# EasyEDA Pro project v2_full_project.epro

# Schematic Schematic2_4
Board Name: 2_4_Minimised; Create Date: 2026-07-24; Page Name: P1; Project Name: Project_PetCollar; Schematic Name: Schematic2_4; Update Date: 2026-07-27; BladeWidth: 10; Company: 嘉立创EDA; Page Size: A4; RegionStart: 1; ShowBorder: 1; TitleBlock: 1; TitleBlockPosition: 3; Version: V1.0; XRegionCount: 6; YRegionCount: 4
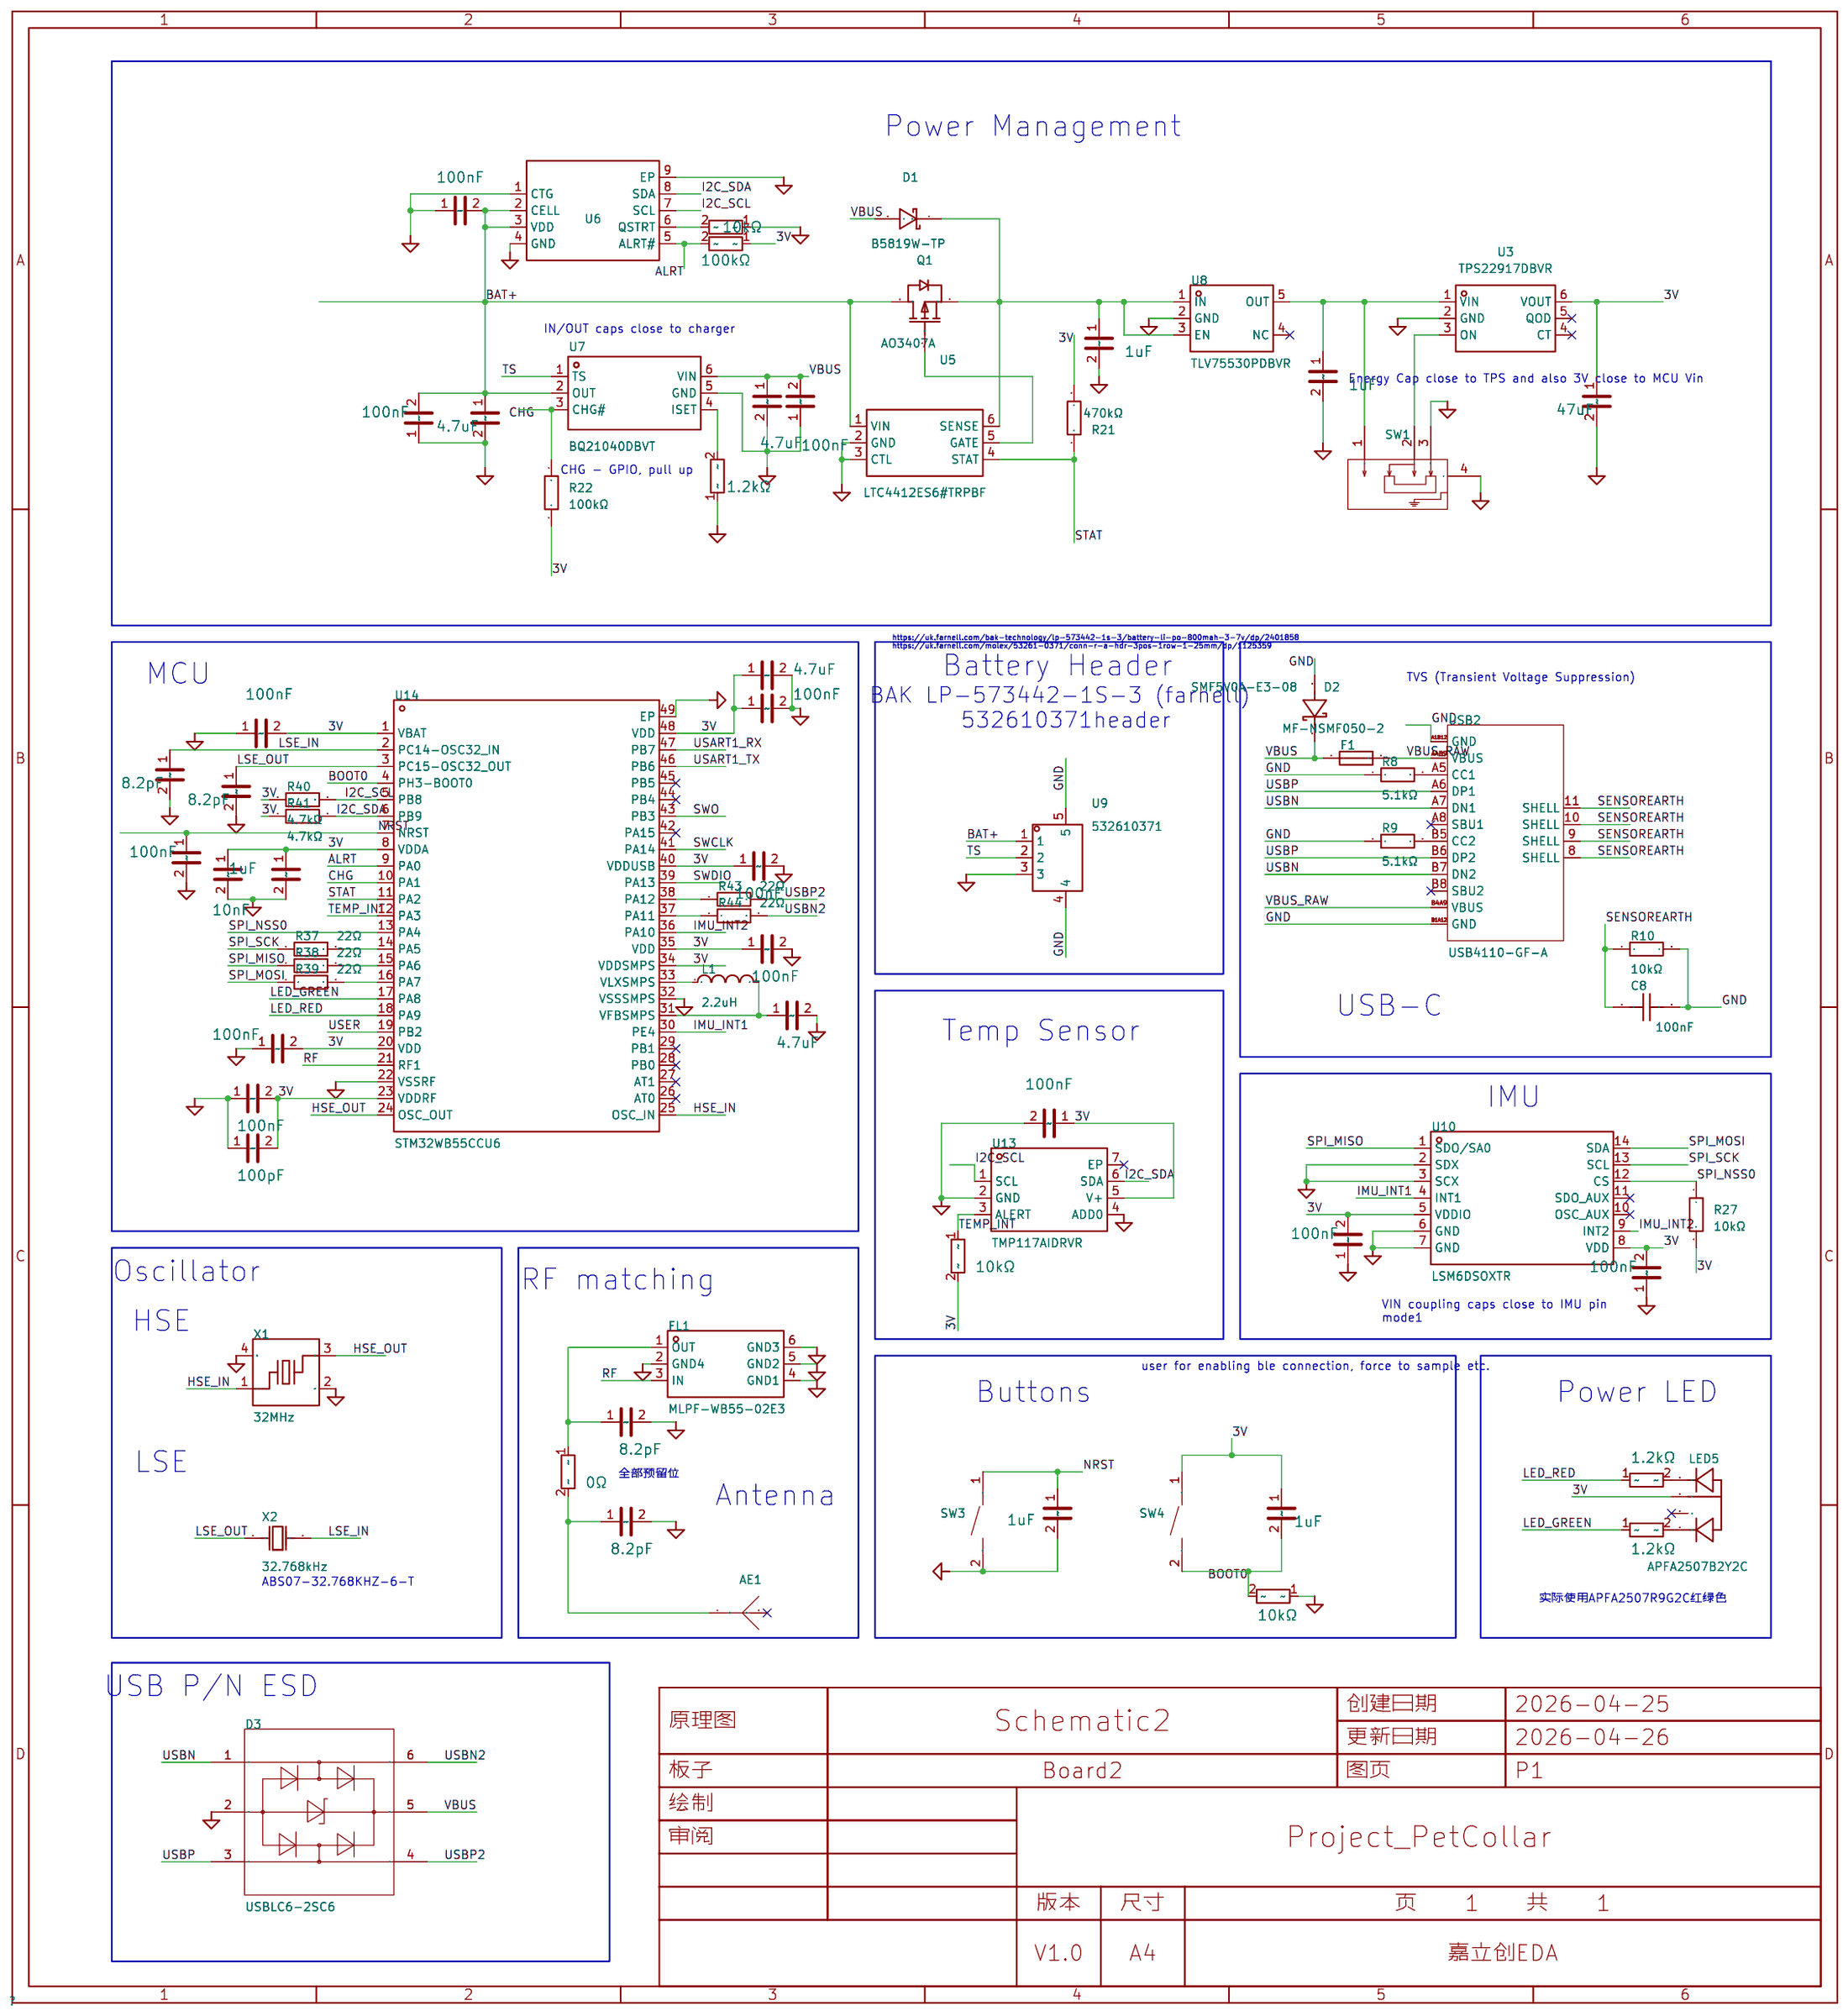
[diagram p0: schematic sheet]

## Parts
AE1  2450AT18A100E  [ANT-SMD_L3.2-W1.6]
C1  100nF  [C0603]
C2  1uF  [C0603]
C3  1uF  [C0603]
C5  47uF  [C0805]
C8  100nF  [C0603]
C19  1uF  [C0603]
C23  4.7uF  [C0603]
C24  4.7uF  [C0603]
C25  100nF  [C0603]
C26  100nF  [C0603]
C27  100nF  [C0603]
C28  100nF  [C0603]
C41  100nF  [C0603]
C42  8.2pF  [C0402]
C43  8.2pF  [C0402]
C46  4.7uF  [C0603]
C49  100nF  [C0603]
C50  100nF  [C0603]
C51  100nF  [C0603]
C52  4.7uF  [C0603]
C53  10nF  [C0603]
C54  1uF  [C0603]
C55  100nF  [C0603]
C56  100nF  [C0603]
C57  100pF  [C0603]
C58  100nF  [C0603]
C59  100nF  [C0603]
C60  1uF  [C0603]
C61  8.2pF  [C0402]
C62  8.2pF  [C0402]
D1  B5819W-TP  [SOD-123_L2.8-W1.8-LS3.7-RD]
D2  SMF5V0A-E3-08  [SMF_L2.8-W1.8-LS3.7-RD]
D3  USBLC6-2SC6  [SOT-23-6_L2.9-W1.6-P0.95-LS2.8-BL]
F1  MF-NSMF050-2  [F1206]
FL1  MLPF-WB55-02E3  [FILTER-SMD_6P-L1.6-W1.0-P0.50-BL]
L1  2.2uH  [L1008]
LED5  APFA2507B2Y2C  [LED-SMD_4P-L2.5-W1.0_APFA2507LQBDSEEZGKC]
Q1  AO3407A  [SOT-23-3_L2.9-W1.6-P1.90-LS2.8-BR]
R1  10kΩ  [R0603]
R2  100kΩ  [R0603]
R8  5.1kΩ  [R0603]
R9  5.1kΩ  [R0603]
R10  10kΩ  [R0603]
R20  1.2kΩ  [R0603]
R21  470kΩ  [R0603]
R22  100kΩ  [R0603]
R27  10kΩ  [R0603]
R35  10kΩ  [R0603]
R36  0Ω  [R0402]
R37  22Ω  [R0603]
R38  22Ω  [R0603]
R39  22Ω  [R0603]
R40  4.7kΩ  [R0603]
R41  4.7kΩ  [R0603]
R42  10kΩ  [R0603]
R43  22Ω  [R0603]
R44  22Ω  [R0603]
R45  1.2kΩ  [R0603]
R46  1.2kΩ  [R0603]
SW1  MSK12C02  [SW-TH_MSK12C02]
SW3  TS-1088-AR02016  [SW-SMD_L3.9-W3.0-P4.45]
SW4  TS-1088-AR02016  [SW-SMD_L3.9-W3.0-P4.45]
U3  TPS22917DBVR  [SOT-23-6_L2.9-W1.6-P0.95-LS2.8-BR]
U5  LTC4412ES6#TRPBF  [TSOT-23-6_L2.9-W1.6-P0.95-LS2.8-BR]
U6  MAX17048G+T10  [TDFN-8_L2.0-W2.0-P0.50-BL-EP1.2]
U7  BQ21040DBVT  [SOT-23-6_L2.9-W1.6-P0.95-LS2.8-BR]
U8  TLV75530PDBVR  [SOT-23-5_L3.0-W1.7-P0.95-LS2.8-BR]
U9  532610371  [CONN-TH_532610371]
U10  LSM6DSOXTR  [LGA-14L_L3.0-W2.5-P0.50-TL]
U13  TMP117AIDRVR  [WSON-6_L2.0-W2.0-P0.65-TL-EP]
U14  STM32WB55CCU6  [VQFN-48_L7.0-W7.0-P0.50-BL-EP5.5]
USB2  USB4110-GF-A  [USB-C-SMD_TYPE-C-16P-USB4110-GF-A]
X1  32MHz  [CRYSTAL-SMD_4P-L2.0-W1.6-BL]
X2  32.768kHz  [CRYSTAL-SMD_L3.2-W1.5-2]

## Library data of the parts
AE1 = 2450AT18A100E: 天线类型:2.4G天线;中心频点:2.4GHz;带宽:-;峰值增益:0.5dBi;极化方式:-;功率容量:2W;驻波比:-;; LCSC Part Name: 2.4G天线; Supplier Part: C89334; Manufacturer: JOHANSON(约翰逊); Supplier Footprint: 1206; JLCPCB Part Class: Extended Part; Datasheet: https://atta.szlcsc.com/upload/public/pdf/source/20180301/C89334_15198946260391384223.pdf; Supplier: LCSC; Antenna Type: 2.4G天线; Central Frequency: 2.4GHz; Peak Gain: 0.5dBi; Impedance: 50Ω; Power capacity: 2W; Operating Temperature: -40℃~+125℃
C1 C25-C28 C41 C49-C51 C55 C56 C58 C59 = CL10B104KB8NNNC: 容值:100nF;精度:±10%;额定电压:50V;温度系数:X7R;; LCSC Part Name: 100nF ±10% 50V; Supplier Part: C1591; Manufacturer: SAMSUNG(三星); Supplier Footprint: 0603; JLCPCB Part Class: Extended Part; Datasheet: https://item.szlcsc.com/datasheet/CL10B104KB8NNNC/1943.html; Supplier: LCSC; Tolerance: ±10%; Voltage Rating: 50V; Temperature Coefficient: X7R
C2 C3 C19 C54 C60 = CL10B105KA8NNNC: 容值:1uF;精度:±10%;额定电压:25V;温度系数:X7R;; LCSC Part Name: 1uF ±10% 25V; Supplier Part: C29936; Manufacturer: SAMSUNG(三星); Supplier Footprint: 0603; JLCPCB Part Class: Extended Part; Datasheet: https://item.szlcsc.com/datasheet/CL10B105KA8NNNC/30690.html; Supplier: LCSC; Tolerance: ±10%; Voltage Rating: 25V; Temperature Coefficient: X7R
C5 = CL21A476MQYNNNE: 容值:47uF;精度:±20%;额定电压:6.3V;温度系数:X5R;; LCSC Part Name: 47uF ±20% 6.3V; Supplier Part: C16780; Manufacturer: SAMSUNG(三星); Supplier Footprint: 0805; JLCPCB Part Class: Basic Part; Datasheet: https://item.szlcsc.com/datasheet/CL21A476MQYNNNE/17464.html; Supplier: LCSC; Tolerance: ±20%; Voltage Rating: 6.3V; Temperature Coefficient: X5R
C8 = CL10B104KB8NNNC: LCSC Part Name: 100nF ±10% 50V; Supplier Part: C1591; Manufacturer: SAMSUNG(三星); Supplier Footprint: 0603; JLCPCB Part Class: Extended Part; Datasheet: https://item.szlcsc.com/datasheet/CL10B104KB8NNNC/1943.html; Supplier: LCSC; Tolerance: ±10%; Voltage Rating: 50V; Temperature Coefficient: X7R
C23 C24 C46 C52 = CL10A475KO8NNNC: 容值:4.7uF;精度:±10%;额定电压:16V;温度系数:X5R;; LCSC Part Name: 4.7uF ±10% 16V; Supplier Part: C19666; Manufacturer: SAMSUNG(三星); Supplier Footprint: 0603; JLCPCB Part Class: Basic Part; Datasheet: https://item.szlcsc.com/datasheet/CL10A475KO8NNNC/20375.html; Supplier: LCSC; Tolerance: ±10%; Voltage Rating: 16V; Temperature Coefficient: X5R
C42 C43 C61 C62 = GJM1555C1H8R2BB01D: 容值:8.2pF;额定电压:50V;材质(温度系数):C0G;; LCSC Part Name: 8.2pF 50V; Supplier Part: C161336; Manufacturer: muRata(村田); Supplier Footprint: 0402; JLCPCB Part Class: Extended Part; Datasheet: https://atta.szlcsc.com/upload/public/pdf/source/20180122/C161336_15166126268751291267.pdf; Supplier: LCSC; Voltage Rated: 50V; Temperature Coefficient: C0G
C53 = GRM1885C1H103JA01D: 容值:10nF;精度:±5%;额定电压:50V;材质(温度系数):C0G;; LCSC Part Name: 10nF ±5% 50V; Supplier Part: C85973; Manufacturer: muRata(村田); Supplier Footprint: 0603; JLCPCB Part Class: Extended Part; Datasheet: https://atta.szlcsc.com/upload/public/pdf/source/20200305/C490387_23319AE8C154DEB24C505E6C82A8106A.pdf; Supplier: LCSC; Tolerance: ±5%; Voltage Rated: 50V; Temperature Coefficient: C0G
C57 = CL10C101JB8NNNC: 容值:100pF;精度:±5%;额定电压:50V;温度系数:C0G;; LCSC Part Name: 100pF ±5% 50V; Supplier Part: C14858; Manufacturer: SAMSUNG(三星); Supplier Footprint: 0603; JLCPCB Part Class: Basic Part; Datasheet: https://item.szlcsc.com/datasheet/CL10C101JB8NNNC/15530.html; Supplier: LCSC; Tolerance: ±5%; Voltage Rating: 50V; Temperature Coefficient: C0G
D1 = B5819W-TP: 二极管配置:-;正向压降(Vf):600mV@1A;直流反向耐压(Vr):40V;整流电流:1A;; LCSC Part Name: 电压:40V 电流:1A; Supplier Part: C84354; Manufacturer: MCC(美微科); Supplier Footprint: SOD-123; JLCPCB Part Class: Extended Part; Datasheet: https://item.szlcsc.com/datasheet/B5819W-TP/85524.html; Supplier: LCSC; Voltage - Forward(Vf@If): 600mV@1A; Voltage - DC Reverse(Vr): 40V; Current - Rectified: 1A; Reverse Leakage Current (Ir): 1mA@40V; Operating Junction Temperature Range: -65℃~+125℃; Non-Repetitive Peak Forward Surge Current: 10A
D2 = SMF5V0A-E3-08: Supplier Part: C1972946; Manufacturer: VISHAY(威世); Supplier Footprint: SMF(DO-219AB); JLCPCB Part Class: 扩展库; Datasheet: https://item.szlcsc.com/datasheet/SMF5V0A-E3-08/2064484.html; Supplier: LCSC; Polarity: 单向; Reverse Stand-Off Voltage (Vrwm): 5V; Clamping Voltage: 9.2V; Peak Pulse Current (Ipp): 21.7A@10/1000us; Peak Pulse Power Dissipation (Ppp): 1kW@8/20us; Voltage - Breakdown: 7.1V; Reverse Leakage Current (Ir): 5uA; Number of Channels: 单路; level of protection: IEC 61000-4-2; Type: ESD; Junction Capacitance: 1120pF
D3 = USBLC6-2SC6_C7519: 极性:单向;反向截止电压(Vrwm):5.25V;钳位电压:17V;峰值脉冲电流(Ipp):5A;击穿电压:6V;; LCSC Part Name: 单向ESD; Supplier Part: C7519; Manufacturer: ST(意法半导体); Supplier Footprint: SOT-23-6L; JLCPCB Part Class: 扩展库; Datasheet: https://item.szlcsc.com/datasheet/USBLC6-2SC6/7996.html; Supplier: LCSC; Polarity: 单向; Reverse Stand-Off Voltage (Vrwm): 5.25V; Clamping Voltage: 17V; Peak Pulse Current (Ipp): 5A; Voltage - Breakdown: 6V; Reverse Leakage Current (Ir): 150nA; Number of Channels: 双路; Operating Temperature: -40℃~+125℃; level of protection: IEC 61000-4-2; Type: ESD; Junction Capacitance: 3.5pF
F1 = MF-NSMF050-2: LCSC Part Name: 0.5A 13.2V 自恢复保险丝; Supplier Part: C75464; Manufacturer: BOURNS; Supplier Footprint: 1206; JLCPCB Part Class: 扩展库; Datasheet: https://item.szlcsc.com/datasheet/MF-NSMF050-2/76588.html; Supplier: LCSC; Resistance - Initial (Ri) (Min): 150mΩ; Resistance - Post Trip (R1) (Max): 700mΩ; Operating Temperature: -40℃~+85℃
FL1 = MLPF-WB55-02E3: LCSC Part Name: 2.45GHz 中心 低通; Supplier Part: C1855732; Manufacturer: ST(意法半导体); Supplier Footprint: SMD-6P,1.6x1mm; JLCPCB Part Class: 扩展库; Datasheet: https://item.szlcsc.com/datasheet/MLPF-WB55-02E3/1946545.html; Supplier: LCSC; Filter Type: 低通; Absolute Bandwidth: 2.4GHz~2.5GHz; Attenuation: 45dB；53dB；44dB；56dB; Impedance: 50Ω; Insertion Loss: 1.2dB; Operating Temperature: -40℃~+105℃
L1 = 1239AS-H-2R2M=P2: LCSC Part Name: 2.2uH ±20% 2.2A; Supplier Part: C237285; Manufacturer: muRata(村田); Supplier Footprint: 1008; JLCPCB Part Class: Extended Part; Datasheet: https://item.szlcsc.com/datasheet/1239AS-H-2R2M%253DP2/236729.html; Supplier: LCSC; Tolerance: ±20%; Current Rating: 2A; Current - Saturation(Isat): 2.2A; DC Resistance(DCR): 108mΩ
LED5 = APFA2507B2Y2C: Supplier Part: C5588645; Manufacturer: Kingbright; Supplier Footprint: SMD-4P,2.5x1.1mm; JLCPCB Part Class: 扩展库; Datasheet: https://atta.szlcsc.com/upload/public/pdf/source/20240415/D4824275CE3160FAD1C5EE74365E5F09.pdf; Supplier: LCSC; Emitted Color: 黄色,蓝色; Forward Voltage (VF): 2V；3.3V; Forward Current: 20mA; Dominant Wavelength: 590nm；465nm; Peak Wavelength: 590nm；460nm; Diode Configuration: 共阳极; Lens Color: 无色透明透镜; Luminous Intensity: 52.5mcd；105mcd; Viewing Angle: 130°
Q1 = AO3407A_C15155: 数量:1个P沟道;漏源电压(Vdss):30V;连续漏极电流(Id):4.3A;导通电阻(RDS(on)):48mΩ@10V;耗散功率(Pd):-;阈值电压(Vgs(th)):2.5V@250uA;; LCSC Part Name: 1个P沟道 耐压:30V 电流:4.3A; Supplier Part: C15155; Manufacturer: AOS; Supplier Footprint: SOT-23; JLCPCB Part Class: Extended Part; Datasheet: https://item.szlcsc.com/datasheet/AO3407A/15829.html; Supplier: LCSC; Number: 1个P沟道; Drain to Source Voltage: 30V; Current - Continuous Drain(Id): 4.3A; RDS(on): 48mΩ@10V; Gate Threshold Voltage (Vgs(th)): 2.5V@250uA; Gate Charge(Qg): 16nC@10V; Input Capacitance(Ciss): 830pF; Reverse Transfer Capacitance (Crss@Vds): 92pF@15V
R1 R35 R42 = RC0603FR-0710KL: 电阻类型:厚膜电阻;阻值:10kΩ;精度:±1%;功率:100mW;最大工作电压:75V;温度系数:±100ppm/℃;; LCSC Part Name: 厚膜电阻 10kΩ ±1% 100mW; Supplier Part: C98220; Manufacturer: YAGEO(国巨); Supplier Footprint: 0603; JLCPCB Part Class: Extended Part; Datasheet: https://atta.szlcsc.com/upload/public/pdf/source/20180927/C295883_E8D83085EA81BD7DE0B2B681138C15EE.pdf; Supplier: LCSC; Type: 厚膜电阻; Tolerance: ±1%; Power(Watts): 100mW; Overload Voltage (Max): 75V; Temperature Coefficient: ±100ppm/℃; Operating Temperature Range: -55℃~+155℃
R2 = RC0603FR-07100KL: 电阻类型:厚膜电阻;阻值:100kΩ;精度:±1%;功率:100mW;最大工作电压:75V;温度系数:±100ppm/℃;; LCSC Part Name: 厚膜电阻 100kΩ ±1% 100mW; Supplier Part: C14675; Manufacturer: YAGEO(国巨); Supplier Footprint: 0603; JLCPCB Part Class: Extended Part; Datasheet: https://atta.szlcsc.com/upload/public/pdf/source/20140324/1457707028752.pdf; Supplier: LCSC; Type: 厚膜电阻; Tolerance: ±1%; Power(Watts): 100mW; Overload Voltage (Max): 75V; Temperature Coefficient: ±100ppm/℃; Operating Temperature Range: -55℃~+155℃
R8 R9 = FRC0603F5102TS: LCSC Part Name: 51kΩ ±1% 100mW 厚膜电阻; Supplier Part: C2907049; Manufacturer: FOJAN(富捷); Supplier Footprint: 0603; JLCPCB Part Class: Extended Part; Supplier: LCSC; Type: 厚膜电阻; Tolerance: ±1%; Power(Watts): 100mW; Voltage-Supply(Max): 75V; Temperature Coefficient: ±100ppm/℃; Operating Temperature: -55℃~+155℃
R10 R27 = RC0603FR-0710KL: LCSC Part Name: 厚膜电阻 10kΩ ±1% 100mW; Supplier Part: C98220; Manufacturer: YAGEO(国巨); Supplier Footprint: 0603; JLCPCB Part Class: Extended Part; Datasheet: https://atta.szlcsc.com/upload/public/pdf/source/20180927/C295883_E8D83085EA81BD7DE0B2B681138C15EE.pdf; Supplier: LCSC; Type: 厚膜电阻; Tolerance: ±1%; Power(Watts): 100mW; Overload Voltage (Max): 75V; Temperature Coefficient: ±100ppm/℃; Operating Temperature Range: -55℃~+155℃
R20 R45 R46 = RC0603FR-071K2L: 电阻类型:厚膜电阻;阻值:1.2kΩ;精度:±1%;功率:100mW;工作电压:75V;温度系数:±100ppm/℃;; LCSC Part Name: 厚膜电阻 1.2kΩ ±1% 100mW; Supplier Part: C114605; Manufacturer: YAGEO(国巨); Supplier Footprint: 0603; JLCPCB Part Class: Extended Part; Datasheet: https://item.szlcsc.com/datasheet/RC0603FR-071K2L/115849.html; Supplier: LCSC; Type: 厚膜电阻; Tolerance: ±1%; Power(Watts): 100mW; Voltage-Supply(Max): 75V; Temperature Coefficient: ±100ppm/℃; Operating Temperature: -55℃~+155℃
R21 = FRC0603F4703TS: LCSC Part Name: 470kΩ ±1% 100mW 厚膜电阻; Supplier Part: C2907040; Manufacturer: FOJAN(富捷); Supplier Footprint: 0603; JLCPCB Part Class: Extended Part; Supplier: LCSC; Type: 厚膜电阻; Tolerance: ±1%; Power(Watts): 100mW; Voltage-Supply(Max): 75V; Temperature Coefficient: ±100ppm/℃; Operating Temperature: -55℃~+155℃
R22 = RC0603FR-07100KL: LCSC Part Name: 厚膜电阻 100kΩ ±1% 100mW; Supplier Part: C14675; Manufacturer: YAGEO(国巨); Supplier Footprint: 0603; JLCPCB Part Class: Extended Part; Datasheet: https://atta.szlcsc.com/upload/public/pdf/source/20140324/1457707028752.pdf; Supplier: LCSC; Type: 厚膜电阻; Tolerance: ±1%; Power(Watts): 100mW; Overload Voltage (Max): 75V; Temperature Coefficient: ±100ppm/℃; Operating Temperature Range: -55℃~+155℃
R36 = RC0402FR-070RL: 电阻类型:厚膜电阻;阻值:0Ω;精度:±1%;功率:62.5mW;工作电压:50V;温度系数:-;; LCSC Part Name: 厚膜电阻 0Ω ±1% 62.5mW; Supplier Part: C106231; Manufacturer: YAGEO(国巨); Supplier Footprint: 0402; JLCPCB Part Class: Extended Part; Datasheet: https://item.szlcsc.com/datasheet/RC0402FR-070RL/107446.html; Supplier: LCSC; Type: 厚膜电阻; Tolerance: ±1%; Power(Watts): 62.5mW; Voltage-Supply(Max): 50V; Operating Temperature: -55℃~+155℃
R37-R39 R43 R44 = FRC0603J220 TS: LCSC Part Name: 22Ω ±5% 100mW 厚膜电阻; Supplier Part: C2907129; Manufacturer: FOJAN(富捷); Supplier Footprint: 0603; JLCPCB Part Class: Extended Part; Supplier: LCSC; Type: 厚膜电阻; Tolerance: ±5%; Power(Watts): 100mW; Voltage-Supply(Max): 75V; Temperature Coefficient: ±100ppm/℃; Operating Temperature: -55℃~+155℃
R40 R41 = RC0603FR-074K7L: LCSC Part Name: 厚膜电阻 4.7kΩ ±1% 100mW; Supplier Part: C99782; Manufacturer: YAGEO(国巨); Supplier Footprint: 0603; JLCPCB Part Class: Extended Part; Datasheet: https://item.szlcsc.com/datasheet/RC0603FR-074K7L/100996.html; Supplier: LCSC; Type: 厚膜电阻; Tolerance: ±1%; Power(Watts): 100mW; Voltage-Supply(Max): 75V; Temperature Coefficient: ±100ppm/℃; Operating Temperature: -55℃~+155℃
SW1 = MSK12C02: 电路结构:单刀双掷;安装方式:卧贴;开关颜色:-;额定电流:50mA;额定电压:12V;工作寿命:1万次;; LCSC Part Name: 两档侧拨贴片 7脚 滑动开关; Supplier Part: C431540; Manufacturer: SHOU HAN(首韩); Supplier Footprint: SMD,8x2.8mm; JLCPCB Part Class: Extended Part; Datasheet: https://item.szlcsc.com/datasheet/MSK12C02/427897.html; Supplier: LCSC; Circuit: 单刀双掷; Termination Style: SMD接片; Length: 8mm; Width: 2.8mm; Switch Height: 1.4mm; Mounting Type: 卧贴; Current Rating: 50mA; Voltage Rating: 12V; Life: 1万次; Operating Temperature: -20℃~+70℃
SW3 SW4 = TS-1088-AR02016: 电路结构:单刀单掷;按钮形状:圆形按钮;作用力:1.6N;安装方式:立贴;开关长度:4mm;开关宽度:3mm;开关高度:2mm;带支架:不带支架;触点电流:50mA;额定电压:12V;工作寿命:10万次;; LCSC Part Name: 4*3*2mm 立贴 轻触开关; Supplier Part: C720477; Manufacturer: XUNPU(讯普); Supplier Footprint: SMD; JLCPCB Part Class: Basic Part; Datasheet: https://item.szlcsc.com/datasheet/TS-1088-AR02016/763484.html; Supplier: LCSC; Circuit: 单刀单掷; Actuator Style: 圆形按钮; Operating Force: 1.6N; Mounting Type: 立贴; Length: 4mm; Width: 3mm; Switch Height: 2mm; with Bracket: 不带支架; Contact Current: 50mA; Voltage Rating: 12V; Actuator/Cap Color: 黑色; Termination Style: SMD接片; Life: 10万次; Operating Temperature: -30℃~+80℃
U3 = TPS22917DBVR: 类型:负载开关;通道数:1;输入控制逻辑:高电平有效;最大连续电流:2A;工作电压:0V~5.5V;导通电阻:80mΩ;; Supplier Part: C2681320; Manufacturer: TI(德州仪器); Supplier Footprint: SOT-23-6; JLCPCB Part Class: Extended Part; Datasheet: https://www.ti.com/cn/lit/gpn/tps22917; Supplier: LCSC; Type: 负载开关; Number of Channels: 1; Control Input Logic: 高电平有效; Maximum Continuous Current: 2A; Voltage - Supply: 0V~5.5V; RDS(on): 80mΩ; Operating Temperature	-: -40℃~+125℃
U5 = LTC4412ES6#TRPBF: 负载类型:MOSFET;工作电压:2.5V~28V;; LCSC Part Name: 低损耗PowerPath控制器; Supplier Part: C514442; Manufacturer: ADI(亚德诺); Supplier Footprint: TSOT-23-6; JLCPCB Part Class: Extended Part; Datasheet: https://item.szlcsc.com/datasheet/LTC4412ES6%2523TRPBF/529483.html; Supplier: LCSC; Load Type: MOSFET; Voltage - Supply: 2.5V~28V; Operating Temperature: -40℃~+85℃
U6 = MAX17048G+T10: 工作电压:2.5V~4.5V;电池类型:锂离子/聚合物;电池节数:1;; LCSC Part Name: 单节/双节电池电量计使用ModelGauge技术; Supplier Part: C2682616; Manufacturer: ADI(亚德诺)/MAXIM(美信); Supplier Footprint: DFN-8-EP(2x2); JLCPCB Part Class: Extended Part; Datasheet: https://item.szlcsc.com/datasheet/MAX17048G%252BT10/2777647.html; Supplier: LCSC; The Chip Type: 电池监测芯片; Voltage - Supply: 2.5V~4.5V; Type of Battery: 锂离子/聚合物; Number of Cells: 1; Operating Temperature: -40℃~+85℃
U7 = BQ21040DBVT: LCSC Part Name: BQ21040DBVT 编带; Supplier Part: C78978; Manufacturer: TI(德州仪器); Supplier Footprint: SOT-23-6; JLCPCB Part Class: 扩展库; Datasheet: https://www.ti.com/cn/lit/gpn/bq21040; Supplier: LCSC; The Chip Type: 充电芯片; Voltage - Supply: 4.45V~6.45V; Charge Current - Max: 800mA; Charging Saturation Voltage: 4.2V; End-Off Voltage: 2.5V; Type of Battery: 锂电池; Number of Cells: 1; Operating Temperature: 0℃~+125℃; Battery Temperature Detection: 支持; 0V Battery Charge: 支持; Supply Current (Iq): 125uA
U8 = TLV75530PDBVR: LCSC Part Name: 3V 500mA 5.5V; Supplier Part: C507268; Manufacturer: TI(德州仪器); Supplier Footprint: SOT-23-5; JLCPCB Part Class: 扩展库; Datasheet: https://www.ti.com/cn/lit/gpn/tlv755p; Supplier: LCSC; Output Type: 固定; Voltage - Supply: 5.5V; Output Voltage: 3V; Output Current: 500mA; Power Supply Rejection Ratio (PSRR): 46dB@(100kHz); Voltage Dropout: 238mV@(500mA); standby current: 25uA; Features: 过流保护；过热保护；短路保护；欠压锁定; Operating Temperature: -40℃~+125℃@(Tj); Output Configuration: 正极; Number of Outputs: 1
U9 = 532610371: LCSC Part Name: 1x3P 间距:1.25mm 卧贴 系列:PicoBlade(MX 1.25); Supplier Part: C293630; Manufacturer: MOLEX; Supplier Footprint: SMD,P=1.25mm,卧贴; JLCPCB Part Class: 扩展库; Datasheet: https://www.molex.com/content/dam/molex/molex-dot-com/products/automated/en-us/salesdrawingpdf/532/53261/532610371_sd.pdf?inline\; Supplier: LCSC; Pins Structure: 1x3P; Pitch: 1.25mm; Mounting Type: 卧贴; Reference Series: PicoBlade(MX 1.25); Number of Pins: 3P; Number of Rows: 1; Number of PINs Per Row: 3; Current Rating: 1A; Contact Material: 磷青铜; Contact Plating: 锡; Operating Temperature: -40℃~+105℃; Voltage Rating: 125V; Plastic Material: 玻纤增强PA; Flame Retardant Rating: UL94V-0; Supplementary Features: 辅助焊脚; Color: 白色; Z-Height of the Board: 3.4mm; X-Length of Bottom Edge on Board (Spacing Line): 8.9mm; Y-Width of Bottom Edge on Board: 5.2mm
U10 = LSM6DSOXTR: Supplier Part: C481766; Manufacturer: ST(意法半导体); Supplier Footprint: LGA-14(2.5x3); JLCPCB Part Class: Extended Part; Datasheet: https://item.szlcsc.com/datasheet/LSM6DSOXTR/489350.html; Supplier: LCSC; Sensor Type: 加速度计陀螺仪; Operating Temperature: -40℃~+85℃
U13 = TMP117AIDRVR: LCSC Part Name: 高精度、低功耗、带SMBus和I2C兼容接口的数字温度传感器; Supplier Part: C699536; Manufacturer: TI(德州仪器); Supplier Footprint: WDFN-6-EP(2x2); JLCPCB Part Class: 扩展库; Datasheet: https://item.szlcsc.com/datasheet/TMP117AIDRVR/734191.html; Supplier: LCSC; Detection Temperature Range: -55℃~+150℃; Tolerance: ±0.1℃; Voltage - Supply: 1.7V~5.5V; Standby Current: 3.1uA; Interface: I2C；SMBus; Temperature Conversion Time: 15.5ms; Temperature Resolution: 16bit
U14 = STM32WB55CCU6: LCSC Part Name: 超低功耗双核64 MHz Arm Cortex-M4 + 32MHz Cortex-M0+ MCU，具有256 KB Flash存储器、蓝牙5, 802.15.4、USB、LCD和AES-256; Supplier Part: C911134; Manufacturer: ST(意法半导体); Supplier Footprint: UFQFPN-48-EP(7x7); JLCPCB Part Class: 扩展库; Datasheet: https://atta.szlcsc.com/upload/public/pdf/source/20221012/63AA3819BB4CA2ABF75106469A6EA842.pdf; Supplier: LCSC
USB2 = USB4110-GF-A: 连接器类型:Type-C;协议标准:USB 2.0;公母:母;安装方式:卧贴;端口数量:1;额定电流 - 电源:5A;工作温度:-40℃~+85℃;; LCSC Part Name: Type-C 母 卧贴; Supplier Part: C5143397; Manufacturer: GCT; Supplier Footprint: SMD; JLCPCB Part Class: 扩展库; Datasheet: https://item.szlcsc.com/datasheet/USB4110-GF-A/5762033.html; Supplier: LCSC; Connector Type: Type-C; Protocol Standard: USB 2.0; Gender: 母; Mounting Type: 卧贴; Number of Ports: 1; Current Rating-Power: 5A; Voltage Rating: 48V; Detection color: 黑色; Operating Temperature: -40℃~+85℃
X1 = NX2016SA-32MHZ-EXS00A-CS06654: LCSC Part Name: 32MHz 8pF; Supplier Part: C5441424; Manufacturer: NDK; Supplier Footprint: SMD2016-4P; JLCPCB Part Class: 扩展库; Datasheet: https://item.szlcsc.com/datasheet/NX2016SA-32MHZ-EXS00A-CS06654/6328498.html; Supplier: LCSC; Load Capacitance: 8pF; Equivalent Series Resistance(ESR): 60Ω; Operating Temperature: -40℃~+125℃
X2 = ABS07-32.768KHZ-6-T: LCSC Part Name: 32.768kHz ±20ppm 6pF; Supplier Part: C1985518; Manufacturer: ABRACON; Supplier Footprint: SMD3215-2P; JLCPCB Part Class: 扩展库; Datasheet: https://item.szlcsc.com/datasheet/ABS07-32.768KHZ-6-T/2077062.html; Supplier: LCSC; Normal temperature Frequency Tolerance: ±20ppm; Load Capacitance: 6pF; Equivalent Series Resistance(ESR): 70kΩ; Operating Temperature: -40℃~+85℃

## Nets
3V: C5.1 C27.2 C28.2 C41.1 C49.2 C50.1 C51.1 C52.1 C53.1 C54.1 C55.1 C56.2 C57.2 C58.2 C60.1 LED5.2 R2.1 R21.2 R22.2 R27.2 R35.2 R40.1 R41.1 SW4.1 U3.6(VOUT) U10.5(VDDIO) U10.8(VDD) U13.5(V+) U14.1(VBAT) U14.8(VDDA) U14.20(VDD) U14.23(VDDRF) U14.34(VDDSMPS) U14.35(VDD) U14.40(VDDUSB) U14.48(VDD)
GND: C1.1 C2.2 C3.2 C5.2 C8.2 C19.2 C23.2 C24.2 C25.1 C26.1 C27.1 C28.1 C41.2 C42.2 C43.2 C46.2 C49.1 C50.2 C51.2 C52.2 C53.2 C54.2 C55.2 C56.1 C57.1 C58.1 C59.2 C61.2 C62.2 D2.2(A) D3.2 FL1.2(GND4) FL1.4(GND1) FL1.5(GND2) FL1.6(GND3) R1.1 R8.1 R9.1 R10.2 R20.1 R42.1 SW1.3 SW1.4 SW3.2 U3.2(GND) U5.2(GND) U5.3(CTL) U6.1(CTG) U6.4(GND) U6.9(EP) U7.5(GND) U8.2(GND) U9.3 U9.4 U9.5 U10.2(SDX) U10.3(SCX) U10.6(GND) U10.7(GND) U13.2(GND) U13.4(ADD0) U14.22(VSSRF) U14.32(VSSSMPS) U14.49(EP) USB2.A1B12(GND) USB2.B1A12(GND) X1.2(GND) X1.4(GND)
VBUS: C23.1 C26.2 D1.2(A) D2.1(K) D3.5 F1.1 U7.6(VIN)
VBUS_RAW: F1.2 USB2.A4B9(VBUS) USB2.B4A9(VBUS)
ALRT: R2.2 U6.5(ALRT#) U14.9(PA0)
BAT+: C1.2 C24.1 C25.2 Q1.3(D) U5.1(VIN) U6.2(CELL) U6.3(VDD) U7.2(OUT) U9.1
BOOT0: C60.2 R42.2 SW4.2 U14.4(PH3-BOOT0)
CHG: R22.1 U7.3(CHG#) U14.10(PA1)
HSE_IN: U14.25(OSC_IN) X1.1
HSE_OUT: U14.24(OSC_OUT) X1.3
I2C_SCL: R40.2 U6.7(SCL) U13.1(SCL) U14.5(PB8)
I2C_SDA: R41.2 U6.8(SDA) U13.6(SDA) U14.6(PB9)
IMU_INT1: U10.4(INT1) U14.30(PE4)
IMU_INT2: U10.9(INT2) U14.36(PA10)
LED_GREEN: R46.1 U14.17(PA8)
LED_RED: R45.1 U14.18(PA9)
LSE_IN: C42.1 U14.2(PC14-OSC32_IN) X2.2(OSC2)
LSE_OUT: C43.1 U14.3(PC15-OSC32_OUT) X2.1(OSC1)
NRST: C19.1 C59.1 SW3.1 U14.7(NRST)
RF: FL1.3(IN) U14.21(RF1)
SENSOREARTH: C8.1 R10.1 USB2.8(SHELL) USB2.9(SHELL) USB2.10(SHELL) USB2.11(SHELL)
SPI_MISO: R38.1 U10.1(SDO/SA0)
SPI_MOSI: R39.1 U10.14(SDA)
SPI_NSS0: R27.1 U10.12(CS) U14.13(PA4)
SPI_SCK: R37.1 U10.13(SCL)
STAT: R21.1 U5.4(STAT) U14.11(PA2)
SWCLK: U14.41(PA14)
SWDIO: U14.39(PA13)
SWO: U14.43(PB3)
TEMP_INT: R35.1 U13.3(ALERT) U14.12(PA3)
TS: U7.1(TS) U9.2
USART1_RX: U14.47(PB7)
USART1_TX: U14.46(PB6)
USBN: D3.1 USB2.A7(DN1) USB2.B7(DN2)
USBN2: D3.6 R44.2
USBP: D3.3 USB2.A6(DP1) USB2.B6(DP2)
USBP2: D3.4 R43.2
USER: U14.19(PB2)
$1N1907: C3.1 SW1.1 U3.1(VIN) U8.5(OUT)
$1N1916: C2.1 D1.1(C) Q1.2(S) U5.6(SENSE) U8.1(IN) U8.3(EN)
$1N1943: Q1.1(G) U5.5(GATE)
$1N1972: SW1.2 U3.3(ON)
$1N1995: R1.2 U6.6(QSTRT)
$1N5876: R20.2 U7.4(ISET)
$1N23961: C61.1 FL1.1(OUT) R36.1
$1N23966: AE1.1(ANT) C62.1 R36.2
$1N24267: C46.1 L1.2 U14.31(VFBSMPS)
$1N24361: L1.1 U14.33(VLXSMPS)
$1N25125: R43.1 U14.38(PA12)
$1N25129: R44.1 U14.37(PA11)
$1N25174: R37.2 U14.14(PA5)
$1N25242: R38.2 U14.15(PA6)
$1N25246: R39.2 U14.16(PA7)
$1N40093: R8.2 USB2.A5(CC1)
$1N40095: R9.2 USB2.B5(CC2)
$1N51880: LED5.1 R45.2
$1N51919: LED5.4 R46.2

Not connected (* = marked no-connect by the designer): AE1 2*; LED5 3*; U3 4(CT)* 5(QOD)*; U8 4(NC)*; U10 10(OSC_AUX)* 11(SDO_AUX)*; U13 7(EP)*; U14 26(AT0)* 27(AT1)* 28(PB0)* 29(PB1)* 42(PA15)* 44(PB4)* 45(PB5)*; USB2 A8(SBU1)* B8(SBU2)*

## Notes on the sheet
- Power Management
- IN/OUT caps close to charger
- Energy Cap close to TPS and also 3V close to MCU Vin
- CHG - GPIO, pull up
- https://uk.farnell.com/bak-technology/lp-573442-1s-3/battery-li-po-800mah-3-7v/dp/2401858
- https://uk.farnell.com/molex/53261-0371/conn-r-a-hdr-3pos-1row-1-25mm/dp/1125359
- Battery Header
- MCU
- TVS (Transient Voltage Suppression)
- BAK LP-573442-1S-3 (farnell)
  532610371header
- USB-C
- Temp Sensor
- IMU
- Oscillator
- RF matching
- VIN coupling caps close to IMU pin
  mode1
- HSE
- user for enabling ble connection, force to sample etc.
- Buttons
- Power LED
- LSE
- 全部预留位
- Antenna
- ABS07-32.768KHZ-6-T
- 实际使用APFA2507R9G2C红绿色
- USB P/N ESD

# Board PCB2_4
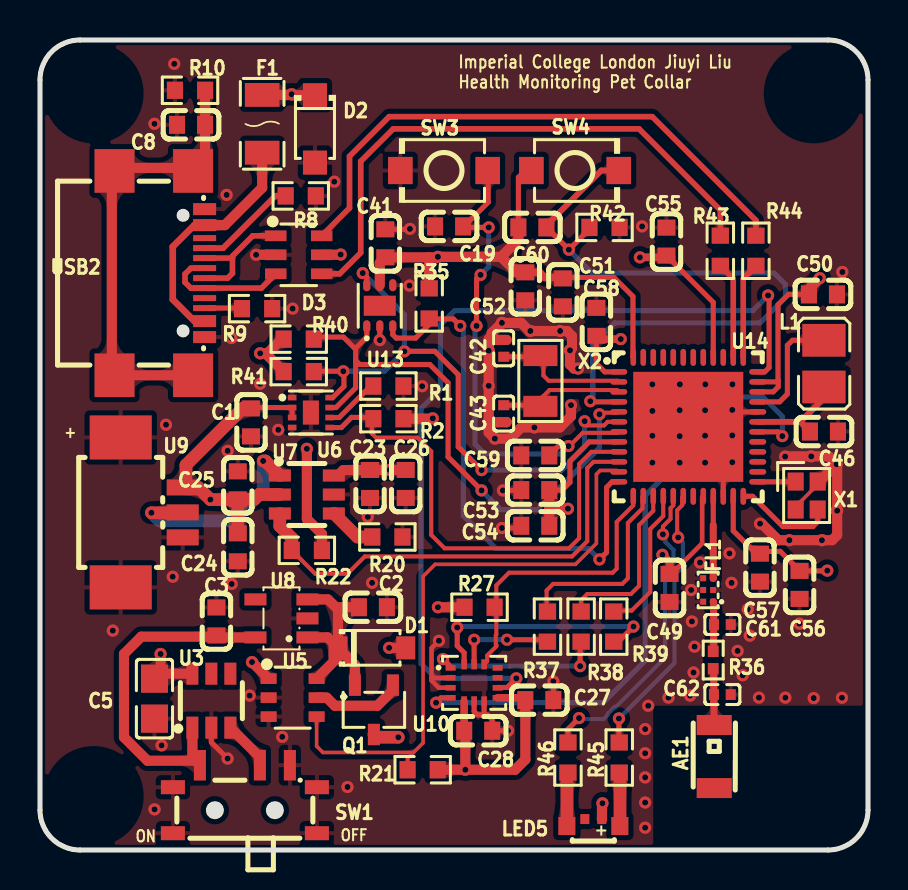
[diagram p1: board, top side]
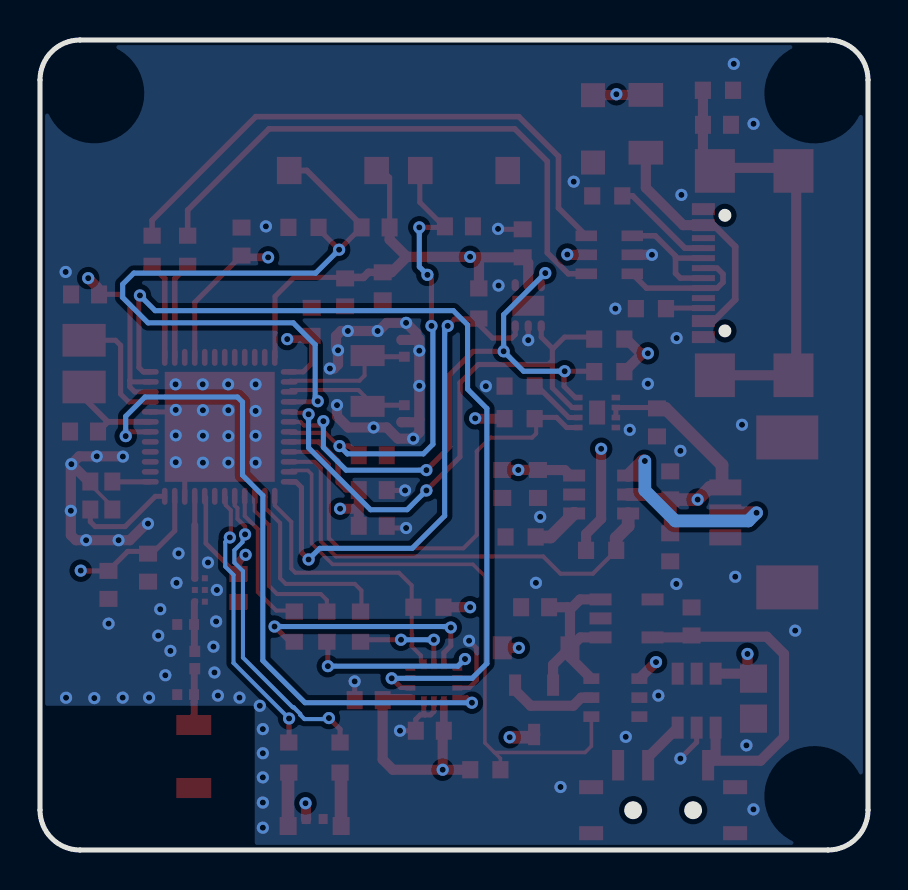
[diagram p2: board, bottom side, seen from below]

Outline 41.4 x 40.52 mm; copper layers: Top Layer, GND, POWER, Bottom Layer. Coordinates in mm from the lower left corner of the outline.
Outline path: 0,38.52 0,2 arc(0.59,0.59) 2,0 39.4,0 arc(40.82,0.59) 41.4,2 41.4,38.52 arc(40.82,39.93) 39.4,40.52 2,40.52 arc(0.59,39.93) 0,38.52
Stack: Top Layer 0.035mm 外层铜厚1oz / Dielectric1 0.2104mm 7628 RC49% 8.6mil / GND 0.0152mm 内层铜厚 / Dielectric2 1.065mm 1.1mm H/HOZ Copper / POWER 0.0152mm 内层铜厚 / Dielectric3 0.2104mm 7628 RC49% 8.6mil / Bottom Layer 0.035mm 外层铜厚1oz

## Design rules (mm)
net USBP: DP1
net USBN: DP1
net USBP2: DP2
net USBN2: DP2
spacing copperThickness1oz (default): track to track 0.102, other pairs 0.102 to 0.3
spacing copperThickness2oz: track to track 0.051, other pairs 0.051 to 0.3
spacing Plane_innerPlane: track to track 0.102, other pairs 0.102 to 0.3
spacing Copper_copperRegion: track to track 0.102, other pairs 0.102 to 0.3
track width copperThickness1oz (default): min 0.089, default 0.254, max 2.54
track width copperThickness2oz: min 0.051, default 0.254, max 2.54
differential pair differentialPair (default): width min 0.127, default 0.292, max 2.54; gap min 0.152, default 0.152
via viaSize (default): diameter min 0.5, default 0.61, max 10; hole min 0.3, default 0.305, max 6.3
net GND uses copperRegion_copperThickness1oz
pour e849 uses Copper_copperRegion, copperRegion_Copper_copperRegion
pour e1013 uses Copper_copperRegion, copperRegion_Copper_copperRegion
pour e1015 uses Copper_copperRegion, copperRegion_Copper_copperRegion
pour e1136 uses Copper_copperRegion, copperRegion_Copper_copperRegion

## Placement (name value [footprint] x y rotation side)
AE1  2450AT18A100E  [ANT-SMD_L3.2-W1.6]  33.72 4.68 270 top
C1  100nF  [C0603]  10.55 21.39 90 top
C2  1uF  [C0603]  16.65 12.14 0 top
C3  1uF  [C0603]  8.82 11.43 90 top
C5  47uF  [C0805]  5.72 7.57 270 top
C8  100nF  [C0603]  7.55 36.27 180 top
C19  1uF  [C0603]  20.46 31.19 180 top
C23  4.7uF  [C0603]  16.5 18.31 270 top
C24  4.7uF  [C0603]  9.89 15.14 270 top
C25  100nF  [C0603]  9.89 18.24 270 top
C26  100nF  [C0603]  18.29 18.31 90 top
C27  100nF  [C0603]  24.97 7.5 180 top
C28  100nF  [C0603]  21.91 5.97 180 top
C41  100nF  [C0603]  17.27 30.35 90 top
C42  8.2pF  [C0402]  23.19 25.09 90 top
C43  8.2pF  [C0402]  23.19 21.83 270 top
C46  4.7uF  [C0603]  39.2 20.93 0 top
C49  100nF  [C0603]  31.48 13.11 90 top
C50  100nF  [C0603]  39.15 27.79 0 top
C51  100nF  [C0603]  26.15 27.89 270 top
C52  4.7uF  [C0603]  24.27 28.2 270 top
C53  10nF  [C0603]  24.77 18 180 top
C54  1uF  [C0603]  24.77 16.22 180 top
C55  100nF  [C0603]  31.33 30.43 90 top
C56  100nF  [C0603]  37.98 13.26 90 top
C57  100pF  [C0603]  36 14.12 90 top
C58  100nF  [C0603]  27.82 26.42 270 top
C59  100nF  [C0603]  24.77 19.74 180 top
C60  1uF  [C0603]  24.62 31.14 0 top
C61  8.2pF  [C0402]  34.12 11.28 0 top
C62  8.2pF  [C0402]  34.12 7.77 0 top
D1  B5819W-TP  [SOD-123_L2.8-W1.8-LS3.7-RD]  16.6 10.11 0 top
D2  SMF5V0A-E3-08  [SMF_L2.8-W1.8-LS3.7-RD]  13.75 36.07 270 top
D3  USBLC6-2SC6  [SOT-23-6_L2.9-W1.6-P0.95-LS2.8-BL]  12.94 29.77 270 top
F1  MF-NSMF050-2  [F1206]  11.11 36.32 270 top
FL1  MLPF-WB55-02E3  [FILTER-SMD_6P-L1.6-W1.0-P0.50-BL]  33.41 13.01 90 top
L1  2.2uH  [L1008]  39.2 24.33 270 top
LED5  APFA2507B2Y2C  [LED-SMD_4P-L2.5-W1.0_APFA2507LQBDSEEZGKC]  27.67 1.37 180 top
Q1  AO3407A  [SOT-23-3_L2.9-W1.6-P1.90-LS2.8-BR]  16.7 7.01 90 top
R1  10kΩ  [R0603]  17.42 23.21 180 top
R2  100kΩ  [R0603]  17.42 21.57 180 top
R8  5.1kΩ  [R0603]  13.04 32.72 180 top
R9  5.1kΩ  [R0603]  10.86 27.08 180 top
R10  10kΩ  [R0603]  7.5 38 180 top
R20  1.2kΩ  [R0603]  17.37 15.66 180 top
R21  470kΩ  [R0603]  19.14 4.02 0 top
R22  100kΩ  [R0603]  13.34 14.99 0 top
R27  10kΩ  [R0603]  21.98 12.14 180 top
R35  10kΩ  [R0603]  19.46 27.34 90 top
R36  0Ω  [R0402]  33.66 9.5 270 top
R37  22Ω  [R0603]  25.38 11.17 90 top
R38  22Ω  [R0603]  27.06 11.17 90 top
R39  22Ω  [R0603]  28.69 11.17 90 top
R40  4.7kΩ  [R0603]  12.94 25.55 0 top
R41  4.7kΩ  [R0603]  12.94 23.93 0 top
R42  10kΩ  [R0603]  28.23 31.14 180 top
R43  22Ω  [R0603]  34.02 29.97 90 top
R44  22Ω  [R0603]  35.8 29.97 90 top
R45  1.2kΩ  [R0603]  28.97 4.62 270 top
R46  1.2kΩ  [R0603]  26.4 4.62 270 top
SW1  MSK12C02  [SW-TH_MSK12C02]  10.25 2.54 0 top
SW3  TS-1088-AR02016  [SW-SMD_L3.9-W3.0-P4.45]  20.2 33.99 180 top
SW4  TS-1088-AR02016  [SW-SMD_L3.9-W3.0-P4.45]  26.76 33.99 0 top
U3  TPS22917DBVR  [SOT-23-6_L2.9-W1.6-P0.95-LS2.8-BR]  8.57 7.47 270 top
U5  LTC4412ES6#TRPBF  [TSOT-23-6_L2.9-W1.6-P0.95-LS2.8-BR]  12.63 7.62 180 top
U6  MAX17048G+T10  [TDFN-8_L2.0-W2.0-P0.50-BL-EP1.2]  13.55 21.88 270 top
U7  BQ21040DBVT  [SOT-23-6_L2.9-W1.6-P0.95-LS2.8-BR]  13.34 17.78 180 top
U8  TLV75530PDBVR  [SOT-23-5_L3.0-W1.7-P0.95-LS2.8-BR]  12.07 11.58 0 top
U9  532610371  [CONN-TH_532610371]  5.59 16.89 270 top
U10  LSM6DSOXTR  [LGA-14L_L3.0-W2.5-P0.50-TL]  21.71 8.36 0 top
U13  TMP117AIDRVR  [WSON-6_L2.0-W2.0-P0.65-TL-EP]  16.99 27.22 90 top
U14  STM32WB55CCU6  [VQFN-48_L7.0-W7.0-P0.50-BL-EP5.5]  32.42 21.17 270 top
USB2  USB4110-GF-A  [USB-C-SMD_TYPE-C-16P-USB4110-GF-A]  5.98 28.86 270 top
X1  32MHz  [CRYSTAL-SMD_4P-L2.0-W1.6-BL]  38.34 17.73 270 top
X2  32.768kHz  [CRYSTAL-SMD_L3.2-W1.5-2]  25.02 23.46 90 top

## Footprints (pads in the part's own frame, mm; a bottom-side part is the same pattern mirrored in y, then rotated)
ANT-SMD_L3.2-W1.6
  rect 1x1.75 smd: 1(-1.578,0) 2(1.578,0)
C0402
  rect 0.5x0.54 smd: 1(-0.42,0) 2(0.42,0)
C0603
  rect 0.8x0.9 smd: 1(-0.7,0) 2(0.7,0)
C0805
  rect 1.41x1.35 smd: 1(-1,0) 2(1,0)
CONN-TH_532610371
  rect 0.8x1.6 smd: 1(-1.25,1.55) 2(0,1.55) 3(1.25,1.55)
  rect 2.2x3.1 smd: 4(3.75,-1.55) 5(-3.75,-1.55)
CRYSTAL-SMD_4P-L2.0-W1.6-BL
  rect 0.9x0.8 smd: 1(-0.7,-0.55) 2(0.7,-0.55) 3(0.7,0.55) 4(-0.7,0.55)
CRYSTAL-SMD_L3.2-W1.5-2
  rect 1.05x1.7 smd: 1(-1.27,0) 2(1.27,0)
F1206
  rect 1.19x1.728 smd: 1(-1.445,0) 2(1.445,0)
FILTER-SMD_6P-L1.6-W1.0-P0.50-BL
  rect 0.3x0.3 smd: 1(-0.587,-0.25) 2(0,-0.25) 3(0.587,-0.25) 4(0.587,0.25) 5(0,0.25) 6(-0.587,0.25)
L1008
  rect 1.635x2.16 smd: 1(-1.167,0) 2(1.167,0)
LED-SMD_4P-L2.5-W1.0_APFA2507LQBDSEEZGKC
  rect 0.85x0.9 smd: 1(-1.325,0.175) 4(1.325,0.175)
  rect 0.45x0.5 smd: 2(-0.425,-0.175) 3(0.425,-0.175)
LGA-14L_L3.0-W2.5-P0.50-TL
  rect 0.5x0.28 smd: 1(-1.175,0.75) 2(-1.175,0.25) 3(-1.175,-0.25) 4(-1.175,-0.75) 8(1.175,-0.75) 9(1.175,-0.25) 10(1.175,0.25) 11(1.175,0.75)
  rect 0.28x0.5 smd: 5(-0.5,-0.925) 6(0,-0.925) 7(0.5,-0.925) 12(0.5,0.925) 13(0,0.925) 14(-0.5,0.925)
R0402
  rect 0.566x0.54 smd: 1(-0.433,0) 2(0.433,0)
R0603
  rect 0.806x0.864 smd: 1(-0.753,0) 2(0.753,0)
SMF_L2.8-W1.8-LS3.7-RD
  rect 1.2x1.2 smd: 1(-1.685,0) 2(1.685,0)
SOD-123_L2.8-W1.8-LS3.7-RD
  rect 0.95x1.15 smd: 1(-1.692,0) 2(1.692,0)
SOT-23-3_L2.9-W1.6-P1.90-LS2.8-BR
  rect 1.07x0.6 smd: 1(1.235,-0.95) 2(1.235,0.95) 3(-1.235,0)
SOT-23-5_L3.0-W1.7-P0.95-LS2.8-BR
  rect 1.1x0.6 smd: 1(1.3,-0.95) 2(1.3,0) 3(1.3,0.95) 4(-1.3,0.95) 5(-1.3,-0.95)
SOT-23-6_L2.9-W1.6-P0.95-LS2.8-BL
  rect 0.532x1.072 smd: 1(-0.95,-1.149) 2(0,-1.149) 3(0.95,-1.149) 4(0.95,1.149) 5(0,1.149) 6(-0.95,1.149)
SOT-23-6_L2.9-W1.6-P0.95-LS2.8-BR
  rect 1.1x0.6 smd: 1(1.35,-0.95) 2(1.35,0) 3(1.35,0.95) 4(-1.35,0.95) 5(-1.35,0) 6(-1.35,-0.95)
SW-SMD_L3.9-W3.0-P4.45
  rect 1.23x1.36 smd: 1(-2.185,0) 2(2.185,0)
SW-TH_MSK12C02
  rect 0.6x1.524 smd: 1(-2.25,1.7) 2(0.75,1.7) 3(2.25,1.7)
  rect 1.2x0.7 smd: 4(-3.6,0.6) 4(-3.6,-1.7) 4(3.6,0.6) 4(3.6,-1.7)
TDFN-8_L2.0-W2.0-P0.50-BL-EP1.2
  rect 0.28x0.425 smd: 1(-0.75,-0.938) 2(-0.25,-0.938) 3(0.25,-0.938) 4(0.75,-0.938) 5(0.75,0.938) 6(0.25,0.938) 7(-0.25,0.938) 8(-0.75,0.938)
  rect 1.2x0.8 smd: 9(0,0)
TSOT-23-6_L2.9-W1.6-P0.95-LS2.8-BR
  rect 0.8x0.532 smd: 1(1.2,-0.95) 2(1.2,0) 3(1.2,0.95) 4(-1.2,0.95) 5(-1.2,0) 6(-1.2,-0.95)
USB-C-SMD_TYPE-C-16P-USB4110-GF-A
  rect 2.18x2 smd: 8(-5.11,1.677) 9(5.11,1.677) 10(-5.11,-2.252) 11(5.11,-2.252)
  rect 0.6x1.15 smd: A1B12(-3.2,2.252) A4B9(-2.4,2.252) B1A12(3.2,2.252) B4A9(2.4,2.252)
  rect 0.3x1.15 smd: A5(-1.25,2.252) A6(-0.25,2.252) A7(0.25,2.252) A8(1.25,2.252) B5(1.75,2.252) B6(0.75,2.252) B7(-0.75,2.252) B8(-1.75,2.252)
VQFN-48_L7.0-W7.0-P0.50-BL-EP5.5
  oval 0.28x0.85 smd: 1(-2.75,-3.474) 2(-2.25,-3.474) 3(-1.75,-3.474) 4(-1.25,-3.474) 5(-0.75,-3.474) 6(-0.25,-3.474) 7(0.25,-3.474) 8(0.75,-3.474) 9(1.25,-3.474) 10(1.75,-3.474) 11(2.25,-3.474) 12(2.75,-3.474) 25(2.75,3.474) 26(2.25,3.474) 27(1.75,3.474) 28(1.25,3.474) 29(0.75,3.474) 30(0.25,3.474) 31(-0.25,3.474) 32(-0.75,3.474) 33(-1.25,3.474) 34(-1.75,3.474) 35(-2.25,3.474) 36(-2.75,3.474)
  oval 0.85x0.28 smd: 13(3.474,-2.75) 14(3.474,-2.25) 15(3.474,-1.75) 16(3.474,-1.25) 17(3.474,-0.75) 18(3.474,-0.25) 19(3.474,0.25) 20(3.474,0.75) 21(3.474,1.25) 22(3.474,1.75) 23(3.474,2.25) 24(3.474,2.75) 37(-3.474,2.75) 38(-3.474,2.25) 39(-3.474,1.75) 40(-3.474,1.25) 41(-3.474,0.75) 42(-3.474,0.25) 43(-3.474,-0.25) 44(-3.474,-0.75) 45(-3.474,-1.25) 46(-3.474,-1.75) 47(-3.474,-2.25) 48(-3.474,-2.75)
  rect 5.5x5.5 smd: 49(0,0)
WSON-6_L2.0-W2.0-P0.65-TL-EP
  oval 0.607x0.364 smd: 1(-1.028,0.65) 2(-1.028,0) 3(-1.028,-0.65) 4(1.028,-0.65) 5(1.028,0) 6(1.028,0.65)
  rect 1x1.6 smd: 7(0,0)

## Nets
As in the schematic.

Pads without a net: AE1 2; LED5 3; U3 4 5; U8 4; U10 10 11; U13 7; U14 26 27 28 29 42 44 45; USB2 A8 B8

## Via types
v1: diameter 0.61, hole 0.305, Top Layer to Bottom Layer, 142 vias

## Routing (per net, layer and track width the routed paths; a pad name or vN(x,y) marks a point on that pad's centre or on a via; arc(x,y) is an arc through that point)
3V: length 216.8
  Top Layer w0.229: 31.58,13.81 33.11,15.34 33.11,17.64 U14.20
  Top Layer w0.254: U14.34 36.66,22.92 36.92,23.17 36.92,23.48 ; C60.1 23.92,33.64 24.27,33.99 SW4.1 ; U14.40 33.67,27.39 C55.1 ; 25.47,18 26.11,18 26.5,18.39 26.5,19.46 27.46,20.42 U14.8 ; 36.92,23.48 36.9,23.49 36.9,27.27 37.43,27.8 38.7,27.8 ; 36.92,23.48 36.85,23.42 U14.35 ; U14.23 34.67,15.97 35.7,14.94 37.02,14.94 37.99,13.96 39.35,13.96 v1(39.37,13.98) ; U14.48 29.65,24.66 29.65,27.69 28.7,28.64 26.2,28.64 ; C58.2 27.82,24.34 28.24,23.92 U14.1
  Top Layer w0.381: C52.1 24.98,28.9 25.23,28.64 26.2,28.64 ; C58.2 27.99,25.55 v1(29.04,25.55) ; U10.8 24.15,7.61 C27.2 ; v1(31.12,14.77) 31.48,14.41 31.48,13.91 31.58,13.81 ; v1(30,29.64) 31.42,29.64 ; 21.21,5.97 U10.5
  Top Layer w0.508: v1(6.03,9.81) 6.03,8.82 U3.6 ; v1(38.99,28.6) 38.54,28.15 38.54,27.96 ; C27.2 24.27,4.53 23.76,4.02 v1(21.27,4.02) ; R22.2 14.1,14.99 14.1,15.81 13.34,16.56 v1(13.34,20.07) ; v1(28.13,2.34) 28.1,2.31 28.1,1.56 LED5.2 ; 23.06,29.67 23.92,30.53 C60.1 ; 23.06,29.67 23.83,28.9 C52.1 ; 23.06,29.67 v1(19.9,29.67) 19.87,29.65 19.45,29.65 ; v1(19.64,21.59) 19.62,21.57 18.07,21.57 ; C54.1 25.47,17.07 ; 25.47,17.07 25.47,18 ; 25.47,17.07 v1(26.4,17.07) ; R27.2 v1(19.9,12.14) ; 19.45,29.65 C41.1 16.99,29.37 U13.5 ; 19.45,29.65 19.45,28.11 19.49,28.07 ; R21.2 v1(21.27,4.02) ; v1(21.27,4.02) 21.27,5.91 C28.2 ; 12.18,25.66 11.37,24.84 11.27,24.84 R41.1 ; 21.18,6 21.21,5.97
  POWER w0.381: v1(31.12,14.77) 32.05,14.77 33.07,15.79 33.07,18.3 33.56,18.8 34.22,18.8 34.73,18.29 34.73,15.63 36.39,13.98 v1(39.37,13.98)
  POWER w0.508: 18.83,13.2 29.55,13.2 v1(31.12,14.77) ; 18.83,13.2 18.83,20.32 ; 18.83,13.2 18.83,12.14 ; 18.83,20.32 18.58,20.07 v1(13.34,20.07) 13.34,22.51 v1(11.01,24.84) ; 18.83,20.32 18.83,20.78 v1(19.64,21.59) 19.9,21.85 19.9,28.06 ; 18.83,17.02 18.88,17.07 v1(26.4,17.07) ; v1(21.27,4.02) 17.46,4.02 14.51,6.96 8.87,6.96 v1(6.03,9.81) ; v1(21.27,4.02) 26.45,4.02 v1(28.13,2.34) ; v1(21.27,4.02) 18.83,6.45 18.83,12.14 ; 18.83,12.14 v1(19.9,12.14) ; 19.9,28.06 v1(19.9,29.67) ; 19.9,28.06 26.54,28.06 v1(29.04,25.55) 30,26.51 v1(30,29.64) 31.04,28.6 v1(38.99,28.6)
GND: length 55.9
  Top Layer w0.178: 38.89,18.43 38.89,18.28 37.79,17.18 X1.2
  Top Layer w0.229: 20.53,8.11 20.53,8.12 19.94,8.12 19.58,8.48 19.58,8.61 ; 19.58,8.61 20.53,8.61 ; 19.58,8.61 19.58,10.1 v1(19.95,10.47)
  Top Layer w0.254: U10.6 21.71,6.93 21.88,6.76 22.15,6.76 ; v1(23.1,16.11) 23.95,16.11 C54.2 ; U10.7 22.21,6.82 22.15,6.76 ; v1(18.5,31.07) 18.48,31.05 C41.2 ; 22.15,6.76 22.39,6.76 22.61,6.53 C28.1 v1(23.4,5.97) ; U14.32 35.89,21.91 33.34,21.91 v1(33.26,22) 32.43,21.17 U14.49 34.17,19.42 U14.22 ; 25.67,7.5 v1(25.67,8.44) ; U13.2 v1(16.99,25.5) ; 24.07,18 24.05,17.99 v1(23.15,17.99) ; v1(9.38,4.57) 8.57,5.39 U3.2
  Top Layer w0.508: v1(26.55,22.25) 26.55,21.69 25.99,21.14 v1(24.72,21.14) 24.06,21.14 23.5,20.58 v1(22.74,20.58) 22.44,20.88 22.44,21.55 ; 22.44,21.55 v1(22.44,23.22) v1(22.44,24.98) 22.44,25.55 22.59,25.71 ; 22.44,21.55 22.59,21.4 23.32,21.4 23.34,21.41 ; 23.34,25.51 22.78,25.51 22.59,25.71 ; 22.59,25.71 22.59,25.86 v1(23.1,26.37) 24.06,26.37 24.47,25.96 v1(24.52,25.96) v1(26.01,25.96) 26.35,25.96 26.6,25.71 26.6,25.1 v1(26.5,25) 26.5,24.28 26.71,24.08 v1(26.91,24.08) ; 38.89,18.43 38.97,18.43 v1(39.84,19.3) ; v1(37.26,19.68) 37.27,19.69 v1(38.57,19.69) 39.44,19.69 v1(39.84,19.3) ; v1(39.84,19.3) 39.86,19.27 v1(39.86,16.97) 39.86,15.75 39.61,15.5 v1(39.1,15.5) v1(37.47,15.5) 36.92,15.5 36.09,16.32 v1(36.01,16.32) ; v1(10.8,29.77) D3.2
  vias: v1(3.64,10.98) v1(5.72,36.32) v1(5.73,2.03) v1(6.08,5.23) v1(6.3,21.27) v1(6.64,13.67) v1(6.71,39.32) v1(9.33,32.77) v1(9.38,19.97) v1(9.57,25.61) v1(9.59,13.31) v1(10.48,7.72) v1(11.01,23.32) v1(11.91,21.02) v1(12.11,5.66) v1(12.63,27.08) v1(14.72,33.43) v1(15.38,3.15) v1(16.39,16.66) v1(16.61,13.36) v1(18.48,28.23) v1(19.11,23.2) v1(30.11,31.19) v1(30.26,6.05) v1(30.26,4.84) v1(30.26,3.63) v1(30.26,2.37) v1(30.26,1.12) v1(30.41,7.22) v1(30.62,23.29) v1(30.62,21.96) v1(30.62,20.72) v1(30.62,19.37) v1(31.43,7.62) v1(31.99,22) v1(31.99,20.7) v1(31.99,19.38) v1(32,23.29) v1(32.56,13.01) v1(32.51,7.72) v1(32.6,11.43) v1(32.68,8.88) v1(32.73,10.17) v1(33,14.38) v1(33.27,23.29) v1(33.26,20.72) v1(33.26,19.38) v1(34.48,14.84) v1(34.58,13.36) v1(34.63,23.29) v1(34.62,22.01) v1(34.62,20.74) v1(34.62,19.4) v1(34.88,9.96) v1(35.14,8.74) v1(35.39,12.04) v1(35.49,10.72) v1(35.95,7.62) v1(37.27,7.62) v1(37.98,11.32) v1(38.69,7.6) v1(40.12,28.91) v1(40.1,7.62)
VBUS: length 48.8
  Top Layer w0.508: D2.1 12.58,37.76 v1(12.58,37.8) 12.55,37.77 F1.1 ; v1(15.04,29.79) 15.02,29.77 D3.5 ; D1.2 v1(17.46,10.11) ; C26.2 v1(17.49,19.01) C23.1 16.5,19.01 15.17,19.01 14.9,18.73 U7.6
  POWER w0.508: v1(12.58,37.8) 10.6,35.82 10.6,30.94 ; v1(17.46,10.11) 17.46,18.92 17.52,18.98 17.52,18.98 v1(17.49,19.01) 12.62,19.01 8.82,22.81 8.82,29.16 10.6,30.94 ; 10.6,30.94 13.88,30.94 v1(15.04,29.79)
VBUS_RAW: length 12.1
  Top Layer w0.33: USB2.B4A9 7.72,26.46 6.64,27.54 6.64,30.18 7.72,31.26 USB2.A4B9
  Top Layer w0.508: 11.11,34.88 11.11,33.12 9.24,31.26 8.28,31.26
ALRT: length 24.4
  Top Layer w0.203: U14.9 27.57,19.92 26.96,19.31 26.96,15.6 26.45,15.09 20.23,15.09 19.56,15.76 19.56,19.94 18.88,20.63 16.8,20.63 16.6,20.83 16.6,21.55 16.57,21.57
  Top Layer w0.254: U6.5 15.07,21.13 15.58,21.64 16.5,21.64 16.57,21.57
BAT+: length 35.2
  Top Layer w0.254: U6.3 U6.2 10.59,22.13 C1.2
  Top Layer w0.508: v1(10.6,9.4) 10.61,9.4 U5.1
  Top Layer w0.635: C1.2 10.13,22.09 7.3,19.26 7.3,18.14 7.91,18.14 v1(8.52,17.53) 9.78,17.53 9.79,17.54 C25.2 ; C25.2 C24.1 ; C25.2 10.71,17.54 10.96,17.78 U7.2 ; v1(17.92,5.64) 16.83,5.64 Q1.3
  POWER w0.635: v1(17.92,5.64) 14.16,9.4 v1(10.6,9.4) 8.5,11.5 8.5,17.51 v1(8.52,17.53)
BOOT0: length 35.1
  Top Layer w0.254: U14.4 27.55,22.42 v1(27.52,22.45) ; R42.2 27.48,31.06 v1(26.45,30.03) 25.33,31.14 C60.2
  Top Layer w0.292: SW4.2 28.06,33.99 25.32,31.24 C60.2
  Bottom Layer w0.254: v1(26.45,30.03) 27.62,28.86 36.71,28.86 37.27,28.3 37.27,27.64 36,26.37 28.74,26.37 27.64,25.28 27.64,22.58 v1(27.52,22.45)
CHG: length 23.4
  Top Layer w0.203: R22.1 13.76,13.82 15.38,13.82 16.24,14.68 26.6,14.68 27.37,15.45 27.37,19.1 27.68,19.42 U14.10
  Top Layer w0.635: R22.1 12.59,15.6 11.99,16.2 11.99,16.83
HSE_IN: length 1.9
  Top Layer w0.254: U14.25 37.77,18.42 X1.1
HSE_OUT: length 5.1
  Top Layer w0.254: U14.24 35.64,17.69 37.15,16.18 38.64,16.18 38.89,16.42 38.89,17.03
I2C_SCL: length 28.8
  Top Layer w0.203: U14.5 28.86,21.92 28.82,21.87 28.05,21.87 v1(27.97,21.8)
  Top Layer w0.254: 15.78,24.48 15.98,24.28 19.49,24.28 20.41,23.37 20.41,19.66 v1(22.08,17.99) ; 15.78,24.48 15.78,23.12 14.8,22.13 U6.7 ; 15.78,24.48 15.78,25.1 ; 15.78,25.1 15.73,25.1 15.17,25.66 13.69,25.66 ; 15.78,25.1 16.34,25.66 U13.1
  Bottom Layer w0.254: v1(22.08,17.99) 23.05,17.02 24.88,17.02 27.97,20.12 v1(27.97,21.8)
I2C_SDA: length 29.4
  Top Layer w0.203: v1(27.23,21.45) 27.23,21.36 27.36,21.24 28.21,21.24 28.39,21.42 U14.6
  Top Layer w0.254: v1(16.14,28.86) 16.34,28.65 U13.6 ; v1(18.22,24.95) 19.75,24.95 20.91,23.78 20.91,20.17 v1(22.08,19) ; R41.2 13.71,23.95 v1(15.17,23.95) 15.2,23.92 15.2,23.19 14.64,22.63 U6.8
  Bottom Layer w0.254: v1(22.08,19) 26.09,19 27.23,20.14 v1(27.23,21.45) ; v1(15.17,23.95) 17.22,23.95 v1(18.22,24.95) 18.22,26.77 v1(16.14,28.86)
IMU_INT1: length 34.2
  Top Layer w0.254: U14.30 36.91,20.92 v1(37.12,20.7) ; 20.53,7.61 20.05,7.61 v1(19.81,7.37)
  Bottom Layer w0.254: v1(37.12,20.7) 37.12,21.69 36.15,22.66 31.53,22.66 31.28,22.41 31.28,18.75 30.26,17.73 30.26,9.47 28.16,7.37 v1(19.81,7.37)
IMU_INT2: length 44.8
  Top Layer w0.254: U10.9 22.9,8.13 23.36,8.13 v1(23.82,8.59) ; v1(36.41,27.74) 36.46,27.69 36.46,24.13 36.24,23.92 U14.36
  Bottom Layer w0.254: v1(23.82,8.59) 19.8,8.59 19.06,9.33 19.06,22.09 20.02,23.05 20.02,26.27 20.73,26.98 35.65,26.98 v1(36.41,27.74)
LED_GREEN: length 15.7
  Top Layer w0.203: v1(31.15,15.79) 31.15,16.18 31.53,16.56 31.53,17.1 31.67,17.24 31.67,17.69 U14.17
  Top Layer w0.254: v1(26.96,6.6) 26.4,6.04 26.4,5.45
  Bottom Layer w0.203: v1(26.96,6.6) 27.01,6.55 28.18,6.55 28.39,6.76 28.39,6.81 28.72,7.14 28.77,7.14 31.26,9.62 31.26,13.95 31.68,14.38 31.68,15 31.28,15.4 31.28,15.71 31.25,15.74 31.2,15.74 v1(31.15,15.79)
LED_RED: length 13.8
  Top Layer w0.203: v1(31.91,15.63) 31.86,15.68 31.86,16.99 32.12,17.25 32.12,17.64 U14.18
  Top Layer w0.254: 28.95,5.45 v1(28.95,6.58)
  Bottom Layer w0.203: v1(31.91,15.63) 32.14,15.4 32.14,14.18 31.73,13.76 31.73,9.36 v1(28.95,6.58)
LSE_IN: length 6.8
  Top Layer w0.203: 25.17,24.73 25.17,23.73 25.43,23.47 28.88,23.47 U14.2
  Top Layer w0.254: 25.17,24.73 25.12,24.67 23.34,24.67
LSE_OUT: length 6.3
  Top Layer w0.203: 25.17,22.19 25.17,22.7 25.48,23.01 28.85,23.01 U14.3
  Top Layer w0.254: 25.17,22.19 25.12,22.25 23.34,22.25
NRST: length 24.8
  Top Layer w0.203: v1(26.43,20.21) 26.48,20.26 26.53,20.26 27.14,20.87 28.84,20.87 28.89,20.92 U14.7
  Top Layer w0.254: v1(21.83,26.22) 21.83,28.57 v1(22.03,28.77) ; C59.1 25.93,20.21 v1(26.43,20.21) ; v1(22.44,31.14) 21.21,31.14 C19.1 21.21,31.19 22.41,32.4 22.41,33.96 SW3.1
  Bottom Layer w0.254: v1(22.03,28.77) 22.44,29.17 v1(22.44,31.14) ; v1(21.83,26.22) 21.76,26.14 21.76,20.29 22.23,19.81 26.03,19.81 v1(26.43,20.21)
RF: length 4.1
  Top Layer w0.254: U14.21 33.67,16.26
  Top Layer w0.348: 33.67,16.26 33.67,13.6
  Top Layer w0.355: 33.67,13.6 FL1.3
SENSOREARTH: length 23
  Top Layer w0.508: 8.21,38 8.25,37.95 C8.1 8.25,34.56 USB2.8 7.66,34.12 3.59,34.12 3.59,23.75 USB2.9
SPI_MISO: length 9
  Top Layer w0.254: v1(20.15,9.55) 20.53,9.17 20.53,9.11 ; v1(27.01,9.2) 27.01,10.52 27.06,10.57
  Bottom Layer w0.254: v1(20.15,9.55) 20.51,9.2 v1(27.01,9.2)
SPI_MOSI: length 12.1
  Top Layer w0.254: U10.14 21.21,9.87 20.86,10.21 v1(20.86,11.13) ; v1(29.68,11.18) 28.92,10.42 R39.1
  Bottom Layer w0.254: v1(29.68,11.18) 20.91,11.18 v1(20.86,11.13)
SPI_NSS0: length 14.5
  Top Layer w0.203: U10.12 22.36,9.44 22.36,9.73 22.82,10.19 22.82,10.26 22.79,10.29 22.79,10.75 22.82,10.77 22.82,13.24 23.45,13.87 28.64,13.87 28.84,14.07 28.84,16.41 29.67,17.24 U14.13
SPI_SCK: length 4.9
  Top Layer w0.254: v1(23.35,10.52) 25.32,10.52 25.38,10.57 ; U10.13 v1(21.71,10.52)
  Bottom Layer w0.254: v1(21.71,10.52) v1(23.35,10.52)
STAT: length 30.4
  Top Layer w0.178: 18.68,4.88 14.15,4.88 13.83,5.19 U5.4 ; 18.68,4.88 19.16,5.36 19.16,13.69 19.76,14.29 26.78,14.29 27.82,15.34 27.82,18.8 28.01,18.98 28.82,18.98 28.84,18.97 28.89,18.97 U14.11 ; 18.68,4.88 18.38,4.58 18.38,4.07
TEMP_INT: length 26.3
  Top Layer w0.254: U14.12 28.61,18.42 28.33,18.14 28.33,14.89 v1(27.97,14.53) ; v1(21.02,26.22) 20.67,26.56 19.49,26.56 19.49,26.31 18.78,25.61 17.81,25.61 17.64,25.78 U13.3
  Bottom Layer w0.254: v1(27.97,14.53) 27.42,15.09 22.79,15.09 21.17,16.72 21.17,26.06 v1(21.02,26.21)
TS: length 9.9
  Top Layer w0.635: v1(5.57,16.87) 6.38,16.87 6.43,16.82 ; U7.1 11.27,19.46 v1(11.16,19.46)
  Bottom Layer w0.635: v1(11.16,19.46) 11.16,17.99 9.64,16.46 5.98,16.46 v1(5.57,16.87)
USBN: length 6.3
  Top Layer w0.28: USB2.A7 9.39,28.61 9.62,28.84 9.62,29.61 ; 9.62,29.61 9.62,29.71 10.64,30.72 D3.1 ; 9.62,29.61 USB2.B7
USBN2: length 28.6
  Top Layer w0.28: R44.2 35.8,31.5 30.62,36.68 17.46,36.68 15.48,34.7 15.48,32.11 D3.6
USBP: length 6.5
  Top Layer w0.28: USB2.A6 7.55,29.11 7.25,28.81 7.25,28.4 7.54,28.11 USB2.B6 11.07,28.11 11.79,28.82
USBP2: length 28.6
  Top Layer w0.28: 14.09,28.82 14.99,28.82 16.04,29.87 16.04,34.44 17.66,36.07 29.96,36.07 34.02,32.01 R43.2
$1N1907: length 17.3
  Top Layer w0.508: 7.77,4.47 SW1.1 ; 7.77,4.47 7.62,4.62 U3.1 ; 7.77,4.47 5.38,4.47 4.2,5.64 4.2,9.81 5.06,10.67 8.76,10.67 C3.1 8.92,10.63 U8.5
$1N1916: length 10.7
  Top Layer w0.508: D1.1 14.9,9.64 U5.6 ; D1.1 14.9,12.03 ; D1.1 14.38,10.63 U8.1 ; D1.1 15.75,9.27 Q1.2 ; C2.1 15.02,12.14 14.9,12.03 ; 14.9,12.03 14.39,12.53 U8.3
$1N1943: length 4.6
  Top Layer w0.508: Q1.1 17.65,7.99 16.87,7.22 14.74,7.22 14.34,7.62 U5.5
$1N1972: length 2.5
  Top Layer w0.508: U3.3 11,4.64 SW1.2
$1N1995: length 2.7
  Top Layer w0.254: 16.57,23.21 16.53,23.21 14.96,21.63 U6.6
$1N5876: length 2.4
  Top Layer w0.635: 14.69,16.84 14.69,16.84 ; 14.69,16.84 15.87,15.66 R20.2 ; 14.69,16.84 U7.4
$1N23961: length 2.5
  Top Layer w0.348: FL1.1 33.69,12.4 33.69,9.96 33.66,9.93
$1N23966: length 3.1
  Top Layer w0.348: 33.69,6.02 33.7,6.03 33.7,7.4 33.69,7.41 33.69,9.04 R36.2
$1N24267: length 5
  Top Layer w0.292: L1.2 39.2,22.6 38.02,21.42 ; 38.02,21.42 C46.1 ; 38.02,21.42 U14.31
$1N24361: length 6
  Top Layer w0.254: L1.1 37.63,25.5 37.37,25.24 37.37,22.81 36.98,22.42 U14.33
$1N25125: length 4.8
  Top Layer w0.28: U14.38 34.67,28.58 34.02,29.22
$1N25129: length 4.8
  Top Layer w0.28: U14.37 35.17,28.58 35.75,29.16 35.75,29.22
$1N25174: length 9.7
  Top Layer w0.203: 25.38,12.08 25.38,12.16 25.33,12.2 25.33,12.98 25.66,13.31 29.12,13.31 29.4,13.59 29.4,16.36 30.12,17.09 30.12,17.65 U14.14
$1N25242: length 8.4
  Top Layer w0.203: 27.06,12.08 27.06,12.5 27.36,12.8 29.55,12.8 29.96,13.21 29.96,16.26 30.67,16.97 U14.15
$1N25246: length 7.4
  Top Layer w0.203: 31.22,17.64 U14.16 31.17,16.71 30.52,16.06 30.52,12.91 29.59,11.98 28.79,11.98 28.69,12.08
$1N40093: length 5.1
  Top Layer w0.292: R8.2 11.77,32.72 9.16,30.11 USB2.A5
$1N40095: length 1.7
  Top Layer w0.254: 10.1,27.08 10.07,27.11 8.43,27.11
$1N51880: length 2.7
  Top Layer w0.635: 29,3.94 29,1.21 LED5.1
$1N51919: length 2.8
  Top Layer w0.635: 26.45,3.94 26.35,3.84 26.35,1.21 LED5.4

## Copper pours and planes (outline as drawn; the poured copper is in the pictures)
GND on Top Layer: -2.04,45.07 58.09,45.07 58.09,-5.03 -2.04,-5.03
GND on Bottom Layer: -6.77,46.43 52.92,46.43 52.92,-7.31 -6.77,-7.31
GND on GND: -13.28,47.6 63.38,47.6 63.38,-8.89 -13.28,-8.89
GND on POWER: -8.76,46.7 58.35,46.7 58.35,-6.4 -8.76,-6.4

Small or netless copper shapes (teardrops, artwork), in the pictures only: 259 on Top Layer, 25 on Bottom Layer, 32 on POWER

## Text on the board
Top Silkscreen Layer: + | ON | OFF | Imperial College London Jiuyi Liu / Health Monitoring Pet Collar | . | USB到下边框 | 开关到下边框 | 开关到左边框 | USB到左边框 | LED到左边框 | LED到下边框
